# Altium project TrafficLight.PrjPcb
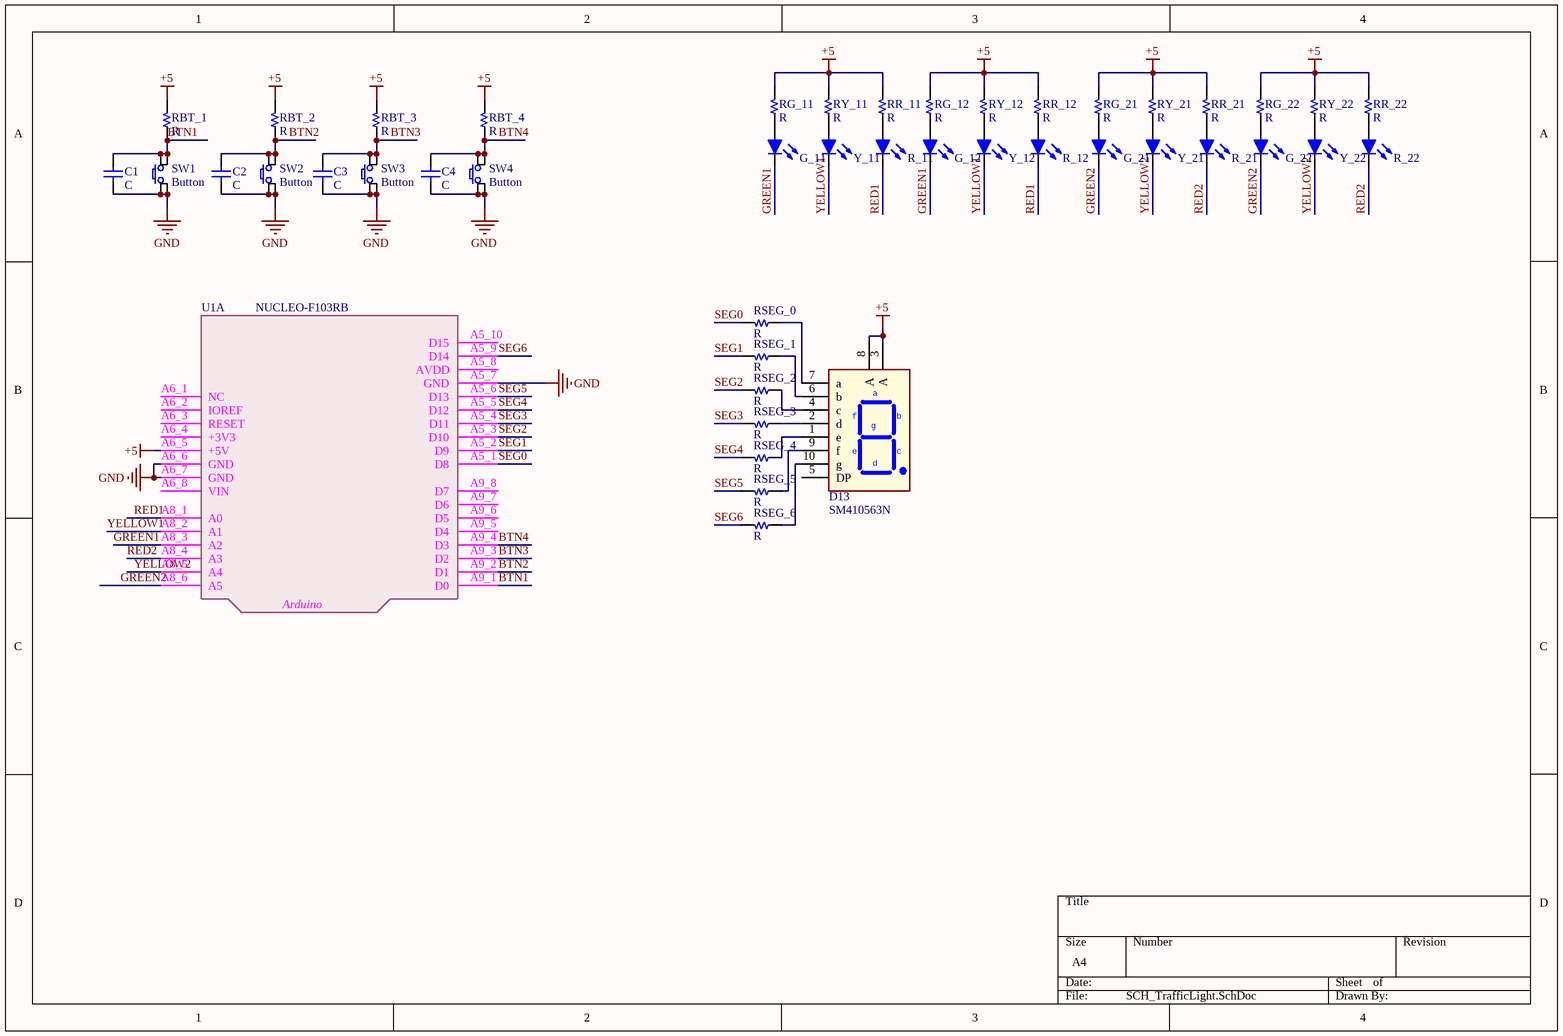
[diagram p0: SCH_TrafficLight.SchDoc]
1 sheet, 45 parts. Net scope: global (net labels, ports and power ports of the same name join across sheets).
Board file: PCB_TrafficLight.PcbDoc

## Sheet SCH_TrafficLight.SchDoc
size A4

### Parts
C1  C  [C 0805]
C2  C  [C 0805]
C3  C  [C 0805]
C4  C  [C 0805]
D13  SM410563N  [LED/7SEG/0.56]
G_11  Led  [LED 3MM - green]  (value not drawn)
G_12  Led  [LED 3MM - green]  (value not drawn)
G_21  Led  [LED 3MM - green]  (value not drawn)
G_22  Led  [LED 3MM - green]  (value not drawn)
R_11  Led  [LED 3MM - red]  (value not drawn)
R_12  Led  [LED 3MM - red]  (value not drawn)
R_21  Led  [LED 3MM - red]  (value not drawn)
R_22  Led  [LED 3MM - red]  (value not drawn)
RBT_1  R  [R 0805]
RBT_2  R  [R 0805]
RBT_3  R  [R 0805]
RBT_4  R  [R 0805]
RG_11  R  [R 0805]
RG_12  R  [R 0805]
RG_21  R  [R 0805]
RG_22  R  [R 0805]
RR_11  R  [R 0805]
RR_12  R  [R 0805]
RR_21  R  [R 0805]
RR_22  R  [R 0805]
RSEG_0  R  [R 0805]
RSEG_1  R  [R 0805]
RSEG_2  R  [R 0805]
RSEG_3  R  [R 0805]
RSEG_4  R  [R 0805]
RSEG_5  R  [R 0805]
RSEG_6  R  [R 0805]
RY_11  R  [R 0805]
RY_12  R  [R 0805]
RY_21  R  [R 0805]
RY_22  R  [R 0805]
SW1  Button  [SW/4/06MM]
SW2  Button  [SW/4/06MM]
SW3  Button  [SW/4/06MM]
SW4  Button  [SW/4/06MM]
U1  NUCLEO-F103RB  [NUCLEO]  (part A of 3)
Y_11  Led  [LED 3MM - yellow]  (value not drawn)
Y_12  Led  [LED 3MM - yellow]  (value not drawn)
Y_21  Led  [LED 3MM - yellow]  (value not drawn)
Y_22  Led  [LED 3MM - yellow]  (value not drawn)

### Nets
+5: D13.3(A) D13.8(A) RBT_1.2 RBT_2.2 RBT_3.2 RBT_4.2 RG_11.2 RG_12.2 RG_21.2 RG_22.2 RR_11.2 RR_12.2 RR_21.2 RR_22.2 RY_11.2 RY_12.2 RY_21.2 RY_22.2 U1.A6_5(+5V)
GND: C1.2 C2.2 C3.2 C4.2 SW1.1 SW1.2 SW2.1 SW2.2 SW3.1 SW3.2 SW4.1 SW4.2 U1.A5_7(GND) U1.A6_6(GND) U1.A6_7(GND)
BTN1: C1.1 RBT_1.1 SW1.3 SW1.4 U1.A9_1(D0)
BTN2: C2.1 RBT_2.1 SW2.3 SW2.4 U1.A9_2(D1)
BTN3: C3.1 RBT_3.1 SW3.3 SW3.4 U1.A9_3(D2)
BTN4: C4.1 RBT_4.1 SW4.3 SW4.4 U1.A9_4(D3)
GREEN1: G_11.2(K) G_12.2(K) U1.A8_3(A2)
GREEN2: G_21.2(K) G_22.2(K) U1.A8_6(A5)
RED1: R_11.2(K) R_12.2(K) U1.A8_1(A0)
RED2: R_21.2(K) R_22.2(K) U1.A8_4(A3)
SEG0: RSEG_0.2 U1.A5_1(D8)
SEG1: RSEG_1.2 U1.A5_2(D9)
SEG2: RSEG_2.2 U1.A5_3(D10)
SEG3: RSEG_3.2 U1.A5_4(D11)
SEG4: RSEG_4.2 U1.A5_5(D12)
SEG5: RSEG_5.2 U1.A5_6(D13)
SEG6: RSEG_6.2 U1.A5_9(D14)
YELLOW1: U1.A8_2(A1) Y_11.2(K) Y_12.2(K)
YELLOW2: U1.A8_5(A4) Y_21.2(K) Y_22.2(K)
NetD13_1: D13.1(e) RSEG_4.1
NetD13_2: D13.2(d) RSEG_3.1
NetD13_4: D13.4(c) RSEG_2.1
NetD13_6: D13.6(b) RSEG_1.1
NetD13_7: D13.7(a) RSEG_0.1
NetD13_9: D13.9(f) RSEG_5.1
NetD13_10: D13.10(g) RSEG_6.1
NetG_11_1: G_11.1(A) RG_11.1
NetG_12_1: G_12.1(A) RG_12.1
NetG_21_1: G_21.1(A) RG_21.1
NetG_22_1: G_22.1(A) RG_22.1
NetR_11_1: R_11.1(A) RR_11.1
NetR_12_1: R_12.1(A) RR_12.1
NetR_21_1: R_21.1(A) RR_21.1
NetR_22_1: R_22.1(A) RR_22.1
NetRY_11_1: RY_11.1 Y_11.1(A)
NetRY_12_1: RY_12.1 Y_12.1(A)
NetRY_21_1: RY_21.1 Y_21.1(A)
NetRY_22_1: RY_22.1 Y_22.1(A)

Not connected (* = marked no-connect by the designer): D13 5(DP); U1 A5_8(AVDD) A5_10(D15) A6_1(NC) A6_2(IOREF) A6_3(RESET) A6_4(+3V3) A6_8(VIN) A9_5(D4) A9_6(D5) A9_7(D6) A9_8(D7)

### Notes on the sheet
- (in symbol NUCLEO-F103RB, part A) Arduino

### Library data of the parts
C1-C4 = Capacitor NP: Capacitor non-pol
D13 = LED 7-SEG SM410563N: SM410563N, Common-Anode, LED 7-seg, RED, 0.56",
G_11 G_12 G_21 G_22 R_11 R_12 R_21 R_22 Y_11 Y_12 Y_21 Y_22 = Led: Typical LED
RBT_1-RBT_4 RG_11 RG_12 RG_21 RG_22 RR_11 RR_12 RR_21 RR_22 RSEG_0-RSEG_6 RY_11 RY_12 RY_21 RY_22 = Resistor
SW1-SW4 = SW SPST 4-pin: Tact switch 4-pin
U1 = NUCLEO-F103RB: STM32F103RB, mbed-Enabled Development Nucleo-64 STM32F1 ARM® Cortex®-M3 MCU 32-Bit Embedded Evaluation Board; Manufacturer: STMicroelectronics; Manufacturer Product Number: NUCLEO-F103RB; BRAND: STMicroelectronics; PART NO: NUCLEO-F103RB; STOCK CODE: 497-14362-ND; SUPPLIER: digi-key; TYPE: EVAL BRD